# Altium schematic sheet 03-Block-Diagram.SchDoc: Block diagram.
size 297 x 209 mm; Author: Dmitry Shpakov; Organization: NoName; Revision: Revision; PageSize: A4; ProjectName: Project Name
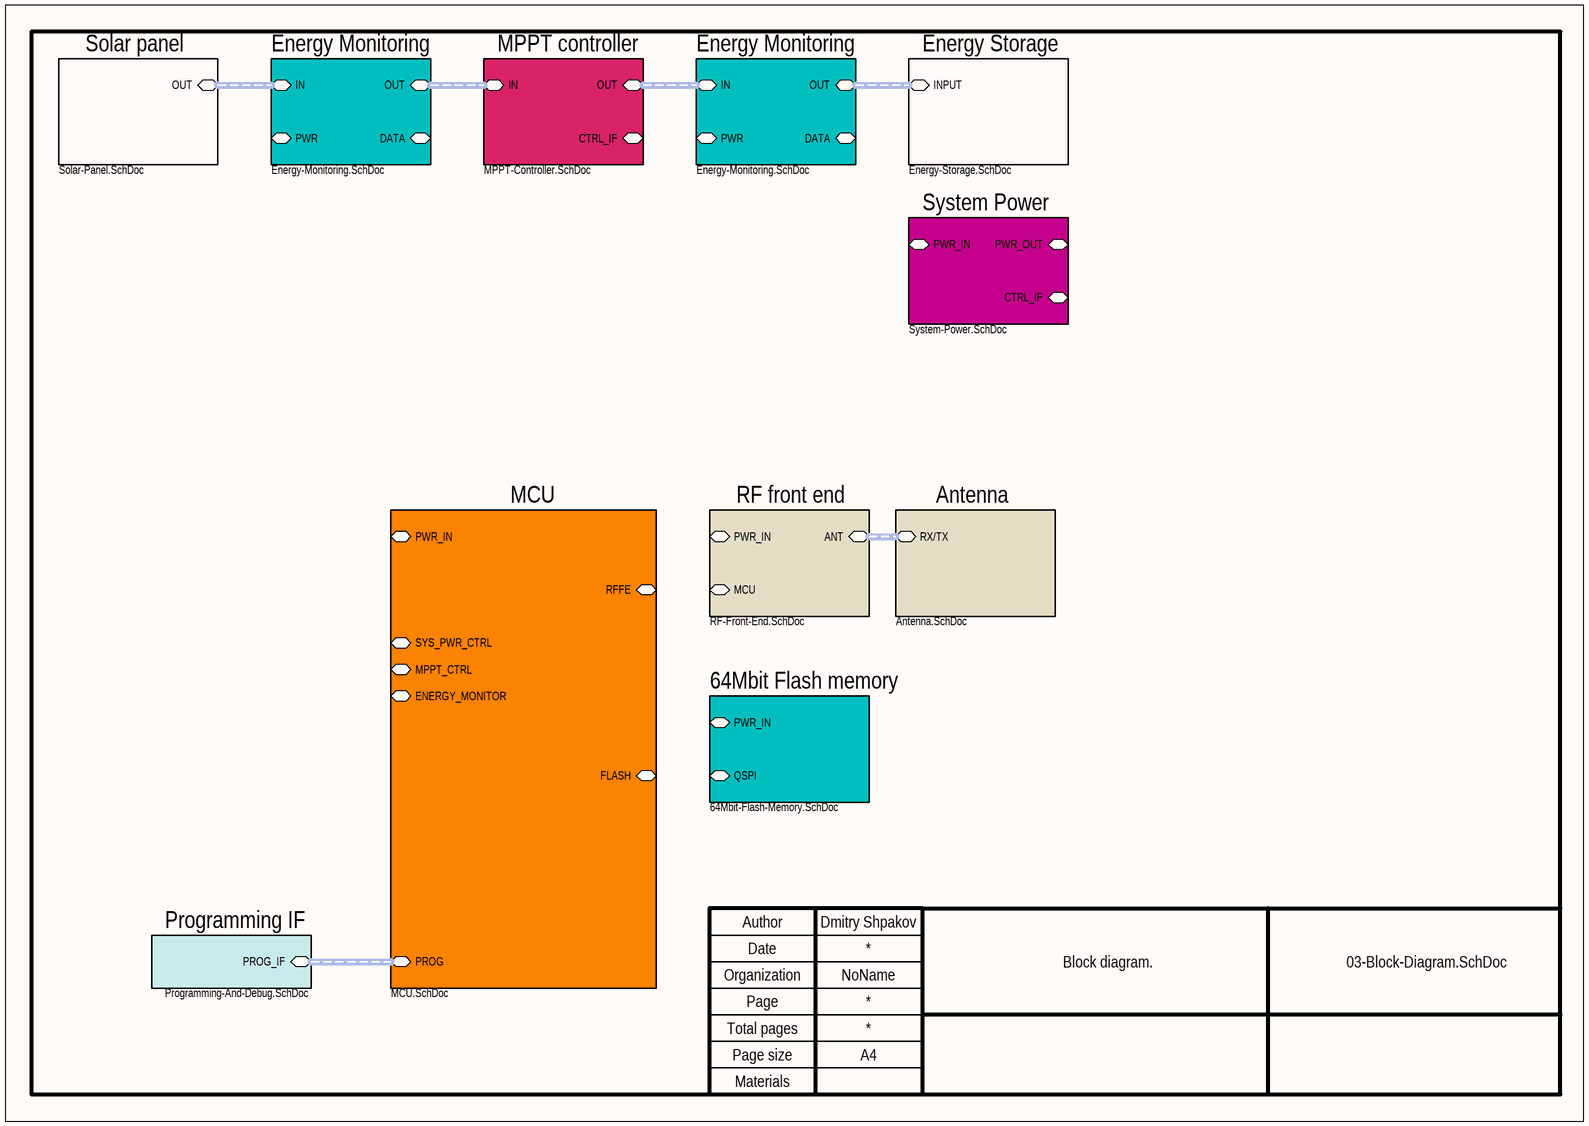
[diagram p0: 03-Block-Diagram.SchDoc]

## Sub-sheets
64Mbit Flash memory = 64Mbit-Flash-Memory.SchDoc: QSPI (harness QSPI), PWR_IN (harness PERIPHERY_PWR)
Antenna = Antenna.SchDoc: RX/TX (harness RF_IF)
Energy Monitoring = Energy-Monitoring.SchDoc: PWR (harness PWR), DATA (harness DATA), IN (harness IN), OUT (harness OUT)
Energy Monitoring = Energy-Monitoring.SchDoc: PWR (harness PWR), DATA (harness DATA), IN (harness IN), OUT (harness OUT)
Energy Storage = Energy-Storage.SchDoc: INPUT (harness BATT_IF)
MCU = MCU.SchDoc: FLASH (harness QSPI), RFFE (harness RF_IF), PWR_IN (harness MCU_PWR), PROG (harness PROG_IF), MPPT_CTRL (harness MPPT_IF), ENERGY_MONITOR (harness ENERGY_MONITOR), SYS_PWR_CTRL (harness SYS_PWR_CTRL)
MPPT controller = MPPT-Controller.SchDoc: OUT (harness BATT_IF), IN (harness SOL_IF), CTRL_IF (harness MPPT_IF)
Programming IF = Programming-And-Debug.SchDoc: PROG_IF (harness PROG_IF)
RF front end = RF-Front-End.SchDoc: ANT (harness RF_IF), MCU (harness RF_IF), PWR_IN (harness RF_PWR)
Solar panel = Solar-Panel.SchDoc: OUT (harness OUT)
System Power = System-Power.SchDoc: PWR_IN (harness PWR_IN), PWR_OUT (harness PWR_OUT), CTRL_IF (harness SYS_PWR_CTRL)

## Buses and harness runs
harness sheet Antenna/RX/TX = sheet RF front end/ANT
harness sheet Energy Monitoring/IN = sheet MPPT controller/OUT
harness sheet Energy Monitoring/IN = sheet Solar panel/OUT
harness sheet Energy Monitoring/OUT = sheet Energy Storage/INPUT
harness sheet Energy Monitoring/OUT = sheet MPPT controller/IN
harness sheet MCU/PROG = sheet Programming IF/PROG_IF

## Notes on the sheet
- Author
- Date
- Organization
- Page
- Total pages
- Materials
- Page size